# EasyEDA Pro project ProProject_si5351-clock_2024-06-27.epro

# Schematic Schematic1
Create Date: 2024-05-31; Page Name: P1; Project Name: si5351-clock; Schematic Name: Schematic1; Update Date: 2024-06-05; Company: EasyEDA.com; Drawn: EasyEDA; Page Size: A4; Part Number: JLCPCB-002; Reviewed: EasyEDA; Version: V0.1
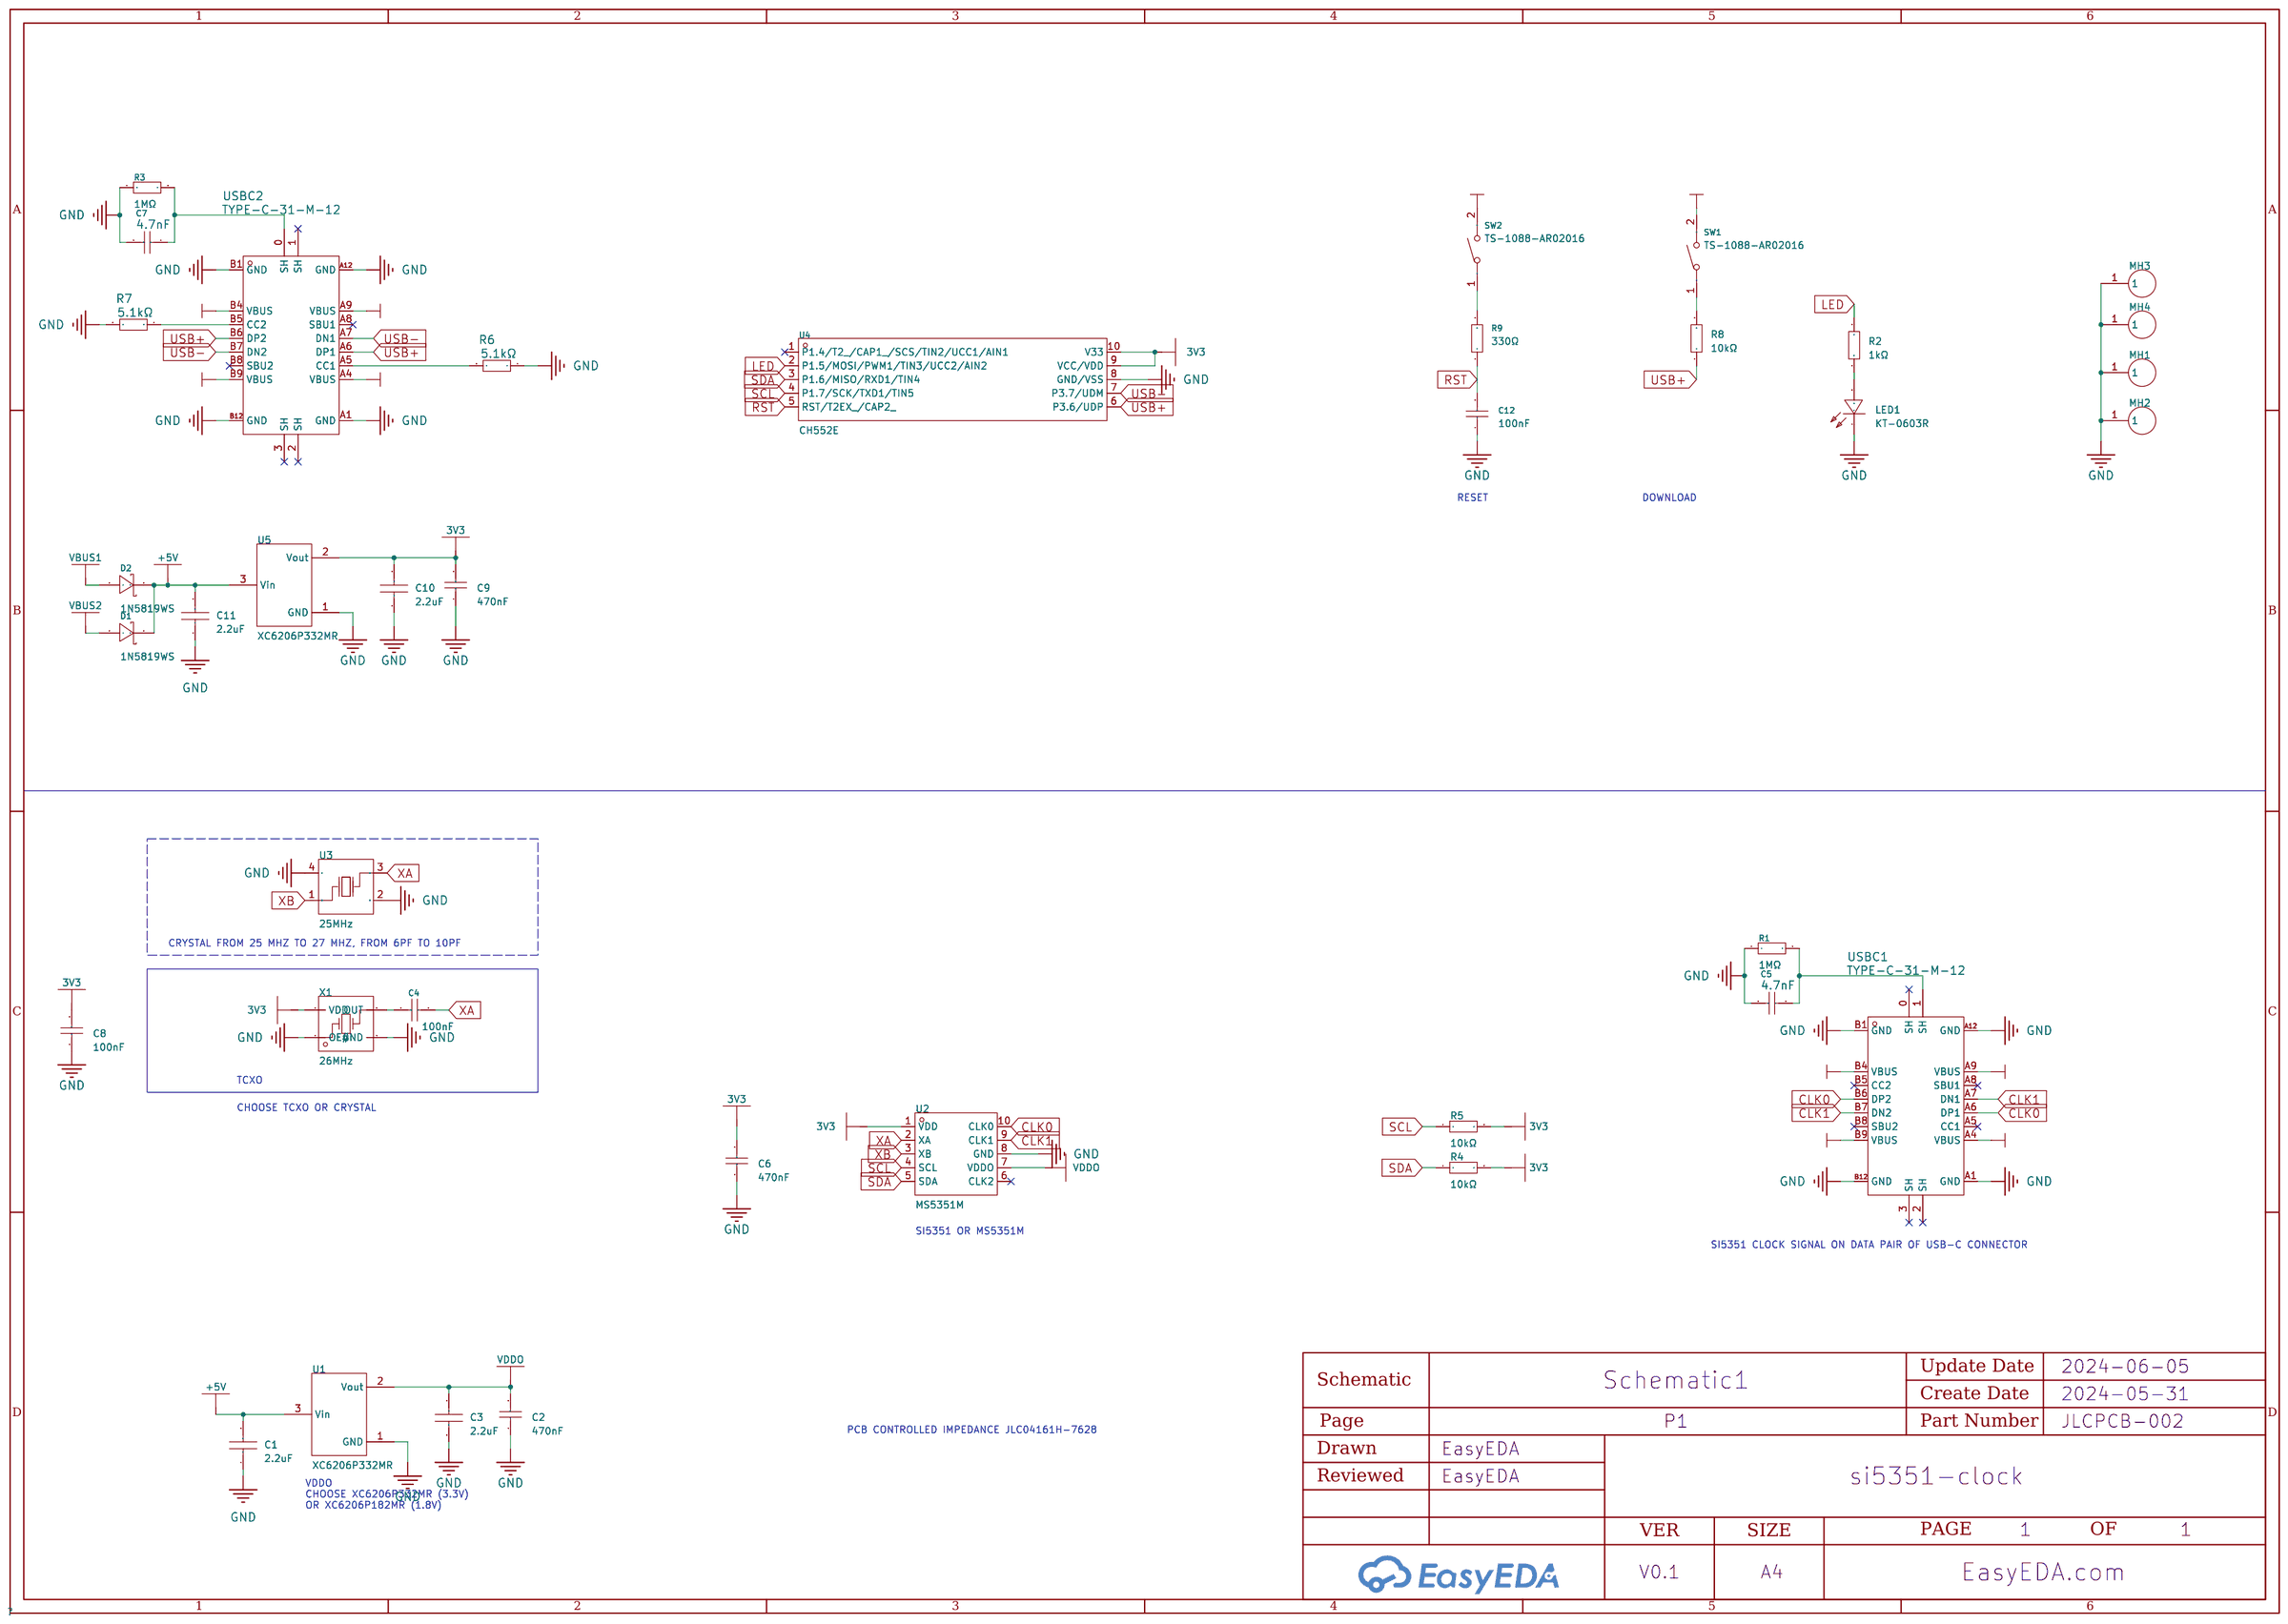
[diagram p0: schematic sheet]

## Parts
C1  2.2uF  [C0402]
C2  470nF  [C0402]
C3  2.2uF  [C0402]
C4  100nF  [C0402]
C5  4.7nF  [C0402]
C6  470nF  [C0402]
C7  4.7nF  [C0402]
C8  100nF  [C0402]
C9  470nF  [C0402]
C10  2.2uF  [C0402]
C11  2.2uF  [C0402]
C12  100nF  [C0402]
D1  1N5819WS  [SOD-323_L1.8-W1.3-LS2.5-RD]
D2  1N5819WS  [SOD-323_L1.8-W1.3-LS2.5-RD]
LED1  KT-0603R  [LED0603-RD]
MH1  -  [3.2mm MountingHole]  (no BOM)
MH2  -  [3.2mm MountingHole]  (no BOM)
MH3  -  [3.2mm MountingHole]  (no BOM)
MH4  -  [3.2mm MountingHole]  (no BOM)
R1  1MΩ  [R0402]
R2  1kΩ  [R0402]
R3  1MΩ  [R0402]
R4  10kΩ  [R0402]
R5  10kΩ  [R0402]
R6  5.1kΩ  [R0402]
R7  5.1kΩ  [R0402]
R8  10kΩ  [R0402]
R9  330Ω  [R0402]
SW1  TS-1088-AR02016  [SW-SMD_L3.9-W3.0-P4.45]
SW2  TS-1088-AR02016  [SW-SMD_L3.9-W3.0-P4.45]
U1  XC6206P332MR  [SOT-23-3_L2.9-W1.6-P1.90-LS2.8-BR]
U2  MS5351M  [MSOP-10_L3.0-W3.0-P0.50-LS5.0-BL]
U3  25MHz  [CRYSTAL-SMD_4P-L3.2-W2.5-BL-1]  (no BOM)
U4  CH552E  [MSOP-10_L3.0-W3.0-P0.50-LS5.0-BL]
U5  XC6206P332MR  [SOT-23-3_L2.9-W1.6-P1.90-LS2.8-BR]
USBC1  TYPE-C-31-M-12  [USB-C_SMD-TYPE-C-31-M-12]
USBC2  TYPE-C-31-M-12  [USB-C_SMD-TYPE-C-31-M-12]
X1  26MHz  [OSC-SMD_4P-L3.2-W2.5-BL_1XTV]

## Library data of the parts
C1 C3 C10 C11 = CL05A225MQ5NSNC: Capacitance: Tolerance:±20% Tolerance:±20% Voltage Rated: Temperature Coefficient:; LCSC Part Name: 2.2uF ±20% 6.3V; Supplier Part: C12530; Manufacturer: SAMSUNG(三星); Supplier Footprint: 0402; JLCPCB Part Class: Basic Part; Datasheet: https://atta.szlcsc.com/upload/public/pdf/source/20160218/1457707763339.pdf; Supplier: LCSC; Tolerance: ±20%
C2 C6 C9 = CL05A474KP5NNNC: Capacitance: Tolerance:±10% Tolerance:±10% Voltage Rated: Temperature Coefficient:; LCSC Part Name: 470nF ±10% 10V; Supplier Part: C47339; Manufacturer: SAMSUNG(三星); Supplier Footprint: 0402; JLCPCB Part Class: Extended Part; Datasheet: https://atta.szlcsc.com/upload/public/pdf/source/20160218/1457707763339.pdf; Supplier: LCSC; Tolerance: ±10%
C4 C8 C12 = CL05B104KO5NNNC: Capacitance:Tolerance:±10%Tolerance:±10%VoltageRated:TemperatureCoefficient:; LCSC Part Name: 100nF±10%16V; Supplier Part: C1525; Manufacturer: SAMSUNG(三星); Supplier Footprint: 0402; JLCPCB Part Class: BasicPart; Datasheet: https://atta.szlcsc.com/upload/public/pdf/source/20160103/1457707674891.pdf; Supplier: LCSC; Tolerance: ±10%
C5 C7 = 4.7nF: link: https://item.szlcsc.com/15869.html; 3DModel: C0402_L1.0-W0.5-H0.5; Supplier: LCSC; Manufacturer: FH(风华); Manufacturer Part: 0402B472K500NT; Supplier Part: C1538; JLCPCB Part Class: BasicPart
D1 D2 = 1N5819WS_C191023: Forward Voltage (Vf@If):600mV@1A Reverse Voltage (Vr):40V Average Rectified Current (Io):1A; LCSC Part Name: 电压:40V 电流:1A; Supplier Part: C191023; Manufacturer: Hottech(合科泰); Supplier Footprint: SOD-323; JLCPCB Part Class: Basic Part; Datasheet: https://atta.szlcsc.com/upload/public/pdf/source/20220428/3CB86FD8D28D653594B4E35F9D5AEFD9.pdf; Supplier: LCSC; Forward Voltage (Vf@If): 600mV@1A; Reverse Voltage (Vr): 40V; Average Rectified Current (Io): 1A
LED1 = KT-0603R: Emitted Color:Red Power Dissipation:- Forward Current:- Dominant Wavelength:- Dominant Wavelength:- Peak Wavelength:- Diode Configuration:- Lens Color:- Color Temperature:- Color Temperature:- Viewing Angle:- Mounting Sytle:- Operating Temperature:-40℃~+8; LCSC Part Name: 0603 红灯 高亮; Supplier Part: C2286; Manufacturer: KENTO; Supplier Footprint: 0603; JLCPCB Part Class: Basic Part; Datasheet: https://atta.szlcsc.com/upload/public/pdf/source/20160616/1466072038404.pdf; Supplier: LCSC; Emitted Color: Red; Operating Temperature: -40℃~+85℃
MH1-MH4 = 3.2mm Mounting Hole: M3
R1 R3 = 0402WGF1004TCE: Resistance:1000000Ω Tolerance:±1% Tolerance:±1% Power(Watts): Overload Voltage (Max): Temperature Coefficient:±100ppm/℃ Temperature Coefficient:±100ppm/℃ Type:Thick Film Resistors Operating Temperature Range:-55℃~+155℃ Operating Temperature Range:-55℃~+15; LCSC Part Name: 1MΩ ±1% 62.5mW 厚膜电阻; Supplier Part: C26083; Manufacturer: UNI-ROYAL(厚声); Supplier Footprint: 0402; JLCPCB Part Class: Basic Part; Datasheet: https://atta.szlcsc.com/upload/public/pdf/source/20200306/C422600_1E6D84923E4A46A82E41ADD87F860B5C.pdf; Supplier: LCSC; Tolerance: ±1%; Temperature Coefficient: ±100ppm/℃; Type: Thick Film Resistors; Operating Temperature Range: -55℃~+155℃
R2 = 0402WGF1001TCE: Type:ThickFilmResistorsResistance:Tolerance:±1%Tolerance:±1%Power(Watts):TemperatureCoefficient:±100ppm/℃TemperatureCoefficient:±100ppm/℃OverloadVoltage(Max):OperatingTemperatureRange:-55℃~+155℃OperatingTemperatureRange:-55℃~+155℃; LCSC Part Name: 1kΩ±1%62.5mW; Supplier Part: C11702; Manufacturer: UNI-ROYAL(厚声); Supplier Footprint: 0402; JLCPCB Part Class: BasicPart; Datasheet: https://atta.szlcsc.com/upload/public/pdf/source/20200306/C422600_1E6D84923E4A46A82E41ADD87F860B5C.pdf; Supplier: LCSC; Type: ThickFilmResistors; Tolerance: ±1%; Temperature Coefficient: ±100ppm/℃; Operating Temperature Range: -55℃~+155℃
R4 R5 R8 = 0402WGF1002TCE: Type:ThickFilmResistorsResistance:Tolerance:±1%Tolerance:±1%Power(Watts):TemperatureCoefficient:±100ppm/℃TemperatureCoefficient:±100ppm/℃OverloadVoltage(Max):OperatingTemperatureRange:-55℃~+155℃OperatingTemperatureRange:-55℃~+155℃; LCSC Part Name: 10kΩ±1%62.5mW; Supplier Part: C25744; Manufacturer: UNI-ROYAL(厚声); Supplier Footprint: 0402; JLCPCB Part Class: BasicPart; Datasheet: https://atta.szlcsc.com/upload/public/pdf/source/20200306/C422600_1E6D84923E4A46A82E41ADD87F860B5C.pdf; Supplier: LCSC; Type: ThickFilmResistors; Tolerance: ±1%; Temperature Coefficient: ±100ppm/℃; Operating Temperature Range: -55℃~+155℃
R6 R7 = 5.1kΩ: link: https://item.szlcsc.com/323315.html; 3DModel: R0402_L1.0-W0.5-H0.5; Supplier: LCSC; Manufacturer: UNI-ROYAL(厚声); Manufacturer Part: 0402WGF5101TCE; Supplier Part: C25905; Resistance: 5.1K; JLCPCB Part Class: BasicPart
R9 = 0402WGF3300TCE: Type:Thick Film Resistors Resistance: Tolerance:±1% Tolerance:±1% Power(Watts): Overload Voltage (Max): Temperature Coefficient:±100ppm/℃ Temperature Coefficient:±100ppm/℃ Operating Temperature Range:-55℃~+155℃ Operating Temperature Range:-55℃~+155℃; LCSC Part Name: 330Ω ±1% 62.5mW 厚膜电阻; Supplier Part: C25104; Manufacturer: UNI-ROYAL(厚声); Supplier Footprint: 0402; JLCPCB Part Class: Basic Part; Datasheet: https://atta.szlcsc.com/upload/public/pdf/source/20200306/C422600_1E6D84923E4A46A82E41ADD87F860B5C.pdf; Supplier: LCSC; Type: Thick Film Resistors; Tolerance: ±1%; Temperature Coefficient: ±100ppm/℃; Operating Temperature Range: -55℃~+155℃
SW1 SW2 = TS-1088-AR02016: Circuit:SPST Actuator Style:Round Button Operating Force:160gf Mounting Style:Brick nogging Switch Length:4mm Switch Width:3mm Switch Height:2mm Strike Gundam:不带 Contact Current:50mA Voltage Rating (DC):12V Insulation Resistance:100MΩ Actuator/Cap Color:B; LCSC Part Name: 4*3*2mm 立贴 轻触开关; Supplier Part: C720477; Manufacturer: XUNPU(讯普); Supplier Footprint: SMD; JLCPCB Part Class: Extended Part; Datasheet: https://atta.szlcsc.com/upload/public/pdf/source/20200810/C720475_60D09DD6C54279ADDB2DC25100F1CC11.pdf; Supplier: LCSC; Circuit: SPST; Actuator Style: Round Button; Operating Force: 160gf; Mounting Style: Brick nogging; Switch Length: 4mm; Switch Width: 3mm; Switch Height: 2mm; Strike Gundam: 不带; Contact Current: 50mA; Voltage Rating (DC): 12V; Insulation Resistance: 100MΩ; Actuator/Cap Color: Black; Pin Style: SMDSplicing; Mechanical Life: 10万次; Operating Temperature: -30℃~+80℃
U1 U5 = XC6206P332MR_C5446: OutputType:OutputPolarity:PositiveNumberofOutputs:1MaximumInputVoltage:6VOutputVoltage:3.3V~3.3VOutputVoltage:3.3V~3.3VDropoutVoltage:680mV@(100mA)OutputCurrent:200mAPowerSupplyRejectionRatio(PSRR):-; Supplier Part: C5446; Manufacturer: TOREX(特瑞仕); Supplier Footprint: SOT-23-3L; JLCPCB Part Class: BasicPart; Datasheet: https://atta.szlcsc.com/upload/public/pdf/source/20130801/1457706628791.pdf; Supplier: LCSC; Output Polarity: Positive; Number of Outputs: 1; Maximum Input Voltage: 6V; Output Voltage: 3.3V~3.3V; Dropout Voltage: 680mV@(100mA); Output Current: 200mA
U2 = MS5351M: Interface:I2C Output Frequency (Max):200MHz Supply Voltage:2.25V~3.6V Supply Voltage:2.25V~3.6V Number of Outputs:3 Output Low Voltage:600mV Output Low Voltage:600mV Output High Voltage:2.7V Output High Voltage:2.7V Operating Temperatue:-55℃~+150℃ Operati; Supplier Part: C1509083; Manufacturer: 杭州瑞盟; Supplier Footprint: MSOP-10; JLCPCB Part Class: Extended Part; Datasheet: https://atta.szlcsc.com/upload/public/pdf/source/20201224/C1509083_CDA7065E1A3FD8463EE02C96BD32A982.pdf; Supplier: LCSC; Interface: I2C; Output Frequency (Max): 200MHz; Supply Voltage: 2.25V~3.6V; Number of Outputs: 3; Output Low Voltage: 600mV; Output High Voltage: 2.7V; Operating Temperatue: -55℃~+150℃
U3 = 3225-25-10-10-10/A: Frequency:25MHz Normal temperature Frequency Tolerance:±10ppm Normal temperature Frequency Tolerance:±10ppm External load capacitor: Operating Temperature: Operating Temperature:; LCSC Part Name: 25MHz ±10ppm 10pF; Supplier Part: C2981674; Manufacturer: LIMING(利明); Supplier Footprint: SMD3225-4P; JLCPCB Part Class: Extended Part; Datasheet: https://atta.szlcsc.com/upload/public/pdf/source/20220322/AC676597CC3A40062114C19917D1493D.pdf; Supplier: LCSC; Normal temperature Frequency Tolerance: ±10ppm
U4 = CH552E: CPU Core:51Series Program Storage Size:16KB RAM Size:1.25KB GPIO Ports Number:- Operating Voltage Range:3.3V~5V Operating Voltage Range:3.3V~5V CPU Maximum Speed:24MHz Program Memory Type:FLASH Operating Temperature Range:-40℃~+85℃ Operating Temperature R; Supplier Part: C967938; Manufacturer: WCH(南京沁恒); Supplier Footprint: MSOP-10; JLCPCB Part Class: Extended Part; Datasheet: https://atta.szlcsc.com/upload/public/pdf/source/20210113/C967938_1C35FF7046C581C5764B019C00B201EC.pdf; Supplier: LCSC; CPU Core: 51Series; Program Storage Size: 16KB; RAM Size: 1.25KB; Operating Voltage Range: 3.3V~5V; CPU Maximum Speed: 24MHz; Program Memory Type: FLASH; Operating Temperature Range: -40℃~+85℃; ADC (Bit): 8bit; PWM (Bit): 8bit; 16Bit Timer: 3; UART/USART: 2; SPI: 1; Universal Serial Bus: 有; Peripheral/Function: DMA；WDT；CCP捕获/比较；Touch button; Watchdog: 有; CCP Capture/Compare: 有; Direct Memory Access: 有; Internal Oscillator: 有
USBC1 USBC2 = TYPE-C-31-M-12: link: https://so.szlcsc.com/global.html?c=&amp;k=C165948; Supplier: LCSC; Supplier Part: C165948; Manufacturer: 韩国韩荣; JLCPCB Part Class: ExtendedPart
X1 = 1XTW26000MAA: Frequency: Frequency Stability(Full temperature range):±0.5ppm Frequency Stability(Full temperature range):±0.5ppm Supply Voltage:1.7V~3.6V Supply Voltage:1.7V~3.6V Supply Current (Max):- Operating Temperature: Operating Temperature:; LCSC Part Name: 26MHz ±0.5ppm 1.7V~3.6V; Supplier Part: C213404; Manufacturer: KDS(大真空); Supplier Footprint: SMD3225-4P; JLCPCB Part Class: Extended Part; Datasheet: https://atta.szlcsc.com/upload/public/pdf/source/20220526/5E8AD46F484F5D63EE5B4F866693FFBE.pdf; Supplier: LCSC; Frequency Stability(Full temperature range): ±0.5ppm; Supply Voltage: 1.7V~3.6V

## Nets
3V3: C6.2 C8.2 C9.2 C10.2 R4.2 R5.2 SW1.2 SW2.2 U2.1(VDD) U4.9(VCC/VDD) U4.10(V33) U5.2(Vout) X1.4(VDD)
+5V: C1.2 C11.2 D1.1(K) D2.1(K) U1.3(Vin) U5.3(Vin)
GND: C1.1 C2.1 C3.1 C5.1 C6.1 C7.1 C8.1 C9.1 C10.1 C11.1 C12.1 LED1.1(K) MH1.1 MH2.1 MH3.1 MH4.1 R1.1 R3.1 R6.1 R7.2 U1.1(GND) U2.8(GND) U3.2(GND) U3.4(GND) U4.8(GND/VSS) U5.1(GND) USBC1.A1(GND) USBC1.A12(GND) USBC1.B1(GND) USBC1.B12(GND) USBC2.A1(GND) USBC2.A12(GND) USBC2.B1(GND) USBC2.B12(GND) X1.1(OE#) X1.2(GND)
VBUS1: D2.2(A) USBC2.A4(VBUS) USBC2.A9(VBUS) USBC2.B4(VBUS) USBC2.B9(VBUS)
VBUS2: D1.2(A) USBC1.A4(VBUS) USBC1.A9(VBUS) USBC1.B4(VBUS) USBC1.B9(VBUS)
VDDO: C2.2 C3.2 U1.2(Vout) U2.7(VDDO)
CLK0: U2.10(CLK0) USBC1.A6(DP1) USBC1.B6(DP2)
CLK1: U2.9(CLK1) USBC1.A7(DN1) USBC1.B7(DN2)
LED: R2.2 U4.2(P1.5/MOSI/PWM1/TIN3/UCC2/AIN2)
RST: C12.2 R9.1 U4.5(RST/T2EX_/CAP2_)
SCL: R5.1 U2.4(SCL) U4.4(P1.7/SCK/TXD1/TIN5)
SDA: R4.1 U2.5(SDA) U4.3(P1.6/MISO/RXD1/TIN4)
USB+: R8.1 U4.6(P3.6/UDP) USBC2.A6(DP1) USBC2.B6(DP2)
USB-: U4.7(P3.7/UDM) USBC2.A7(DN1) USBC2.B7(DN2)
XA: C4.2 U2.2(XA) U3.3(OSC2)
XB: U2.3(XB) U3.1(OSC1)
$1N4118: R8.2 SW1.1
$1N7734: R7.1 USBC2.B5(CC2)
$1N7735: R6.2 USBC2.A5(CC1)
$1N9628: C5.2 R1.2 USBC1.1(SH)
$1N15892: LED1.2(A) R2.1
$1N26853: C4.1 X1.3(OUT)
$1N62932: C7.2 R3.2 USBC2.0(SH)
$1N71108: R9.2 SW2.1

Not connected (* = marked no-connect by the designer): U2 6(CLK2)*; U4 1(P1.4/T2_/CAP1_/SCS/TIN2/UCC1/AIN1)*; USBC1 0(SH)* 2(SH)* 3(SH)* A5(CC1)* A8(SBU1)* B5(CC2)* B8(SBU2)*; USBC2 1(SH)* 2(SH)* 3(SH)* A8(SBU1)* B8(SBU2)*

## Notes on the sheet
- RESET
- DOWNLOAD
- CRYSTAL FROM 25 MHZ TO 27 MHZ, FROM 6PF TO 10PF
- TCXO
- CHOOSE TCXO OR CRYSTAL
- SI5351 OR MS5351M
- SI5351 CLOCK SIGNAL ON DATA PAIR OF USB-C CONNECTOR
- PCB CONTROLLED IMPEDANCE JLC04161H-7628
- VDDO
  CHOOSE XC6206P332MR (3.3V)
  OR XC6206P182MR (1.8V)

# Board PCB1
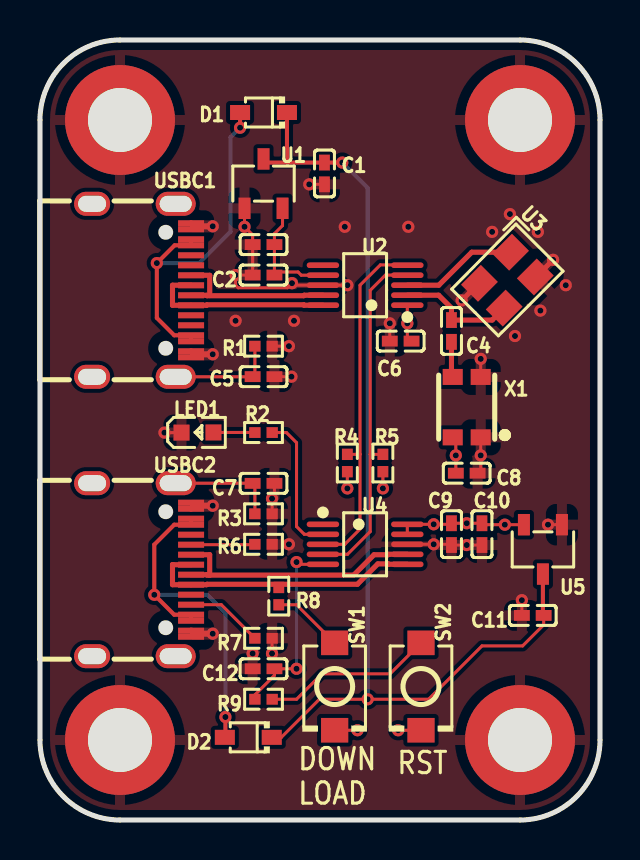
[diagram p1: board, top side]
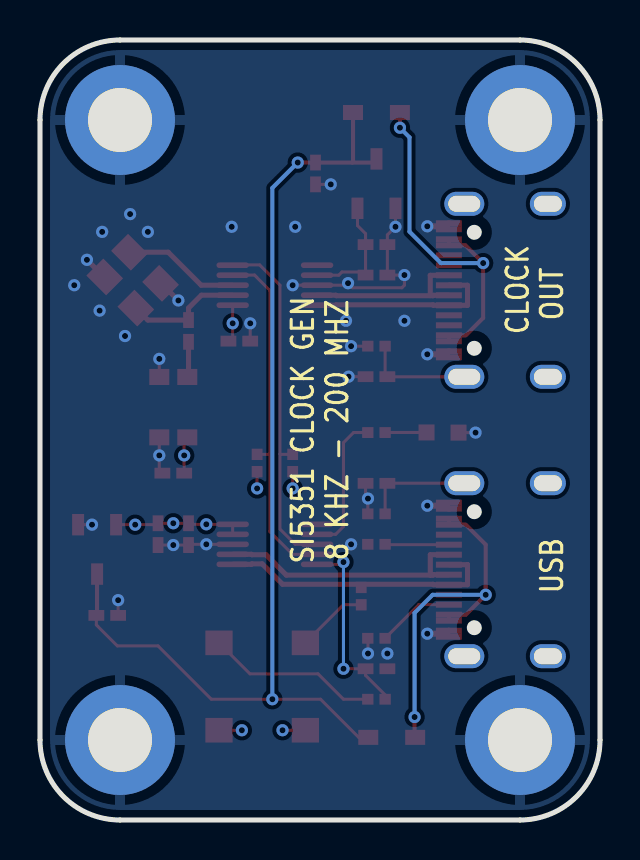
[diagram p2: board, bottom side, seen from below]

Outline 28 x 39 mm; copper layers: Top Layer, Inner1, Inner2, Bottom Layer. Coordinates in mm from the lower left corner of the outline.
Outline path: 0,35 0,4 arc(1.17,1.17) 4,0 24,0 arc(26.83,1.17) 28,4 28,35 arc(26.83,37.83) 24,39 4,39 arc(1.17,37.83) 0,35
Stack: Top Layer 0.035mm 外层铜厚1oz / Dielectric1 0.2104mm 7628 RC49% 8.6mil / Inner1 0.0152mm 内层铜厚 / Dielectric2 1.065mm 1.1mm H/HOZ 含铜 / Inner2 0.0152mm 内层铜厚 / Dielectric3 0.2104mm 7628 RC49% 8.6mil / Bottom Layer 0.035mm 外层铜厚1oz

## Design rules (mm)
net USB+: DP1
net USB-: DP1
net CLK1: DP2
net CLK0: DP2
template: Custom Config
spacing copperThickness1oz (default): track to track 0.102, other pairs 0.152 to 0.3
spacing copperThickness2oz: track to track 0.203, other pairs 0.152 to 0.3
track width copperThickness1oz (default): min 0.127, default 0.254, max 2.54
track width copperThickness2oz: min 0.203, default 0.254, max 2.54
differential pair differentialPair (default): width min 0.127, default 0.254, max 2.54; gap min 0.152, default 0.203
via viaSize (default): diameter min 0.5, default 0.61, max 10; hole min 0.3, default 0.305, max 6.299

## Placement (name value [footprint] x y rotation side)
C1  2.2uF  [C0402]  14.22 32.33 90 top
C2  470nF  [C0402]  11.18 27.25 0 top
C3  2.2uF  [C0402]  11.18 28.77 0 top
C4  100nF  [C0402]  20.57 24.45 90 top
C5  4.7nF  [C0402]  11.18 22.17 180 top
C6  470nF  [C0402]  18.03 23.94 0 top
C7  4.7nF  [C0402]  11.18 16.83 180 top
C8  100nF  [C0402]  21.34 17.34 180 top
C9  470nF  [C0402]  20.57 14.29 90 top
C10  2.2uF  [C0402]  22.1 14.29 90 top
C11  2.2uF  [C0402]  24.64 10.23 0 top
C12  100nF  [C0402]  11.18 7.56 0 top
D1  1N5819WS  [SOD-323_L1.8-W1.3-LS2.5-RD]  11.18 35.38 180 top
D2  1N5819WS  [SOD-323_L1.8-W1.3-LS2.5-RD]  10.41 4.13 180 top
LED1  KT-0603R  [LED0603-RD]  7.87 19.37 0 top
MH1  -  [3.2mm MountingHole]  4 35 0 top
MH2  -  [3.2mm MountingHole]  24 35 0 top
MH3  -  [3.2mm MountingHole]  4 4 0 top
MH4  -  [3.2mm MountingHole]  24 4 0 top
R1  1MΩ  [R0402]  11.18 23.69 180 top
R2  1kΩ  [R0402]  11.18 19.37 0 top
R3  1MΩ  [R0402]  11.18 15.31 180 top
R4  10kΩ  [R0402]  15.37 17.85 270 top
R5  10kΩ  [R0402]  17.15 17.85 270 top
R6  5.1kΩ  [R0402]  11.18 13.78 180 top
R7  5.1kΩ  [R0402]  11.18 9.09 0 top
R8  10kΩ  [R0402]  11.94 11.19 270 top
R9  330Ω  [R0402]  11.18 6.04 0 top
SW1  TS-1088-AR02016  [SW-SMD_L3.9-W3.0-P4.45]  14.73 6.67 270 top
SW2  TS-1088-AR02016  [SW-SMD_L3.9-W3.0-P4.45]  19.05 6.67 270 top
U1  XC6206P332MR  [SOT-23-3_L2.9-W1.6-P1.90-LS2.8-BR]  11.18 31.82 270 top
U2  MS5351M  [MSOP-10_L3.0-W3.0-P0.50-LS5.0-BL]  16.26 26.74 90 top
U3  25MHz  [CRYSTAL-SMD_4P-L3.2-W2.5-BL-1]  23.37 26.99 225 top
U4  CH552E  [MSOP-10_L3.0-W3.0-P0.50-LS5.0-BL]  16.26 13.78 270 top
U5  XC6206P332MR  [SOT-23-3_L2.9-W1.6-P1.90-LS2.8-BR]  25.15 13.53 90 top
USBC1  TYPE-C-31-M-12  [USB-C_SMD-TYPE-C-31-M-12]  5.08 26.48 270 top
USBC2  TYPE-C-31-M-12  [USB-C_SMD-TYPE-C-31-M-12]  5.08 12.52 270 top
X1  26MHz  [OSC-SMD_4P-L3.2-W2.5-BL_1XTV]  21.34 20.64 90 top

## Footprints (pads in the part's own frame, mm; a bottom-side part is the same pattern mirrored in y, then rotated)
3.2mm MountingHole
  round 5.5 hole 3.2: 1(0,0)
C0402
  rect 0.79x0.54 smd: 1(-0.545,0) 2(0.545,0)
CRYSTAL-SMD_4P-L3.2-W2.5-BL-1
  rect 1.4x1.2 smd: 1(-1.1,-0.875) 2(1.1,-0.875) 3(1.1,0.875) 4(-1.1,0.875)
LED0603-RD
  rect 0.8x0.8 smd: 1(-0.799,-0.004) 2(0.799,0.004)
MSOP-10_L3.0-W3.0-P0.50-LS5.0-BL
  oval 0.28x1.62 smd: 1(-1,-2.11) 2(-0.5,-2.11) 3(0,-2.11) 4(0.5,-2.11) 5(1,-2.11) 6(1,2.11) 7(0.5,2.11) 8(0,2.11) 9(-0.5,2.11) 10(-1,2.11)
OSC-SMD_4P-L3.2-W2.5-BL_1XTV
  rect 0.8x1 smd: 1(-1.51,-0.7) 2(1.51,-0.7) 3(1.51,0.7) 4(-1.51,0.7)
R0402
  rect 0.566x0.54 smd: 1(-0.433,0) 2(0.433,0)
SOD-323_L1.8-W1.3-LS2.5-RD
  rect 1x0.75 smd: 1(-1.173,0) 2(1.173,0)
SOT-23-3_L2.9-W1.6-P1.90-LS2.8-BR
  rect 1.07x0.6 smd: 1(1.235,-0.95) 2(1.235,0.95) 3(-1.235,0)
SW-SMD_L3.9-W3.0-P4.45
  rect 1.23x1.36 smd: 1(-2.185,0) 2(2.185,0)
USB-C_SMD-TYPE-C-31-M-12
  oval 1.2x2 hole 0.8x1.6: 0(-4.325,1.706) 1(4.325,1.706)
  oval 1.2x1.8 hole 0.8x1.4: 2(4.325,-2.474) 3(-4.325,-2.474)
  rect 0.3x1.3 smd: A1(-3.35,2.474) A4(-2.55,2.474) A5(-1.25,2.474) A6(-0.25,2.474) A7(0.25,2.474) A8(1.25,2.474) A9(2.55,2.474) A12(3.35,2.474) B1(3.05,2.474) B4(2.25,2.474) B5(1.75,2.474) B6(0.75,2.474) B7(-0.75,2.474) B8(-1.75,2.474) B9(-2.25,2.474) B12(-3.05,2.474)

## Nets
As in the schematic.

Pads without a net: U2 6; U4 1; USBC1 0 2 3 A5 A8 B5 B8; USBC2 1 2 3 A8 B8

## Via types
v1: diameter 0.61, hole 0.305, Top Layer to Bottom Layer, 52 vias

## Routing (per net, layer and track width the routed paths; a pad name or vN(x,y) marks a point on that pad's centre or on a via; arc(x,y) is an arc through that point)
3V3: length 14.1
  Top Layer w0.152: U5.2 v1(23.24,14.77) 22.17,14.77 C10.2 v1(21.34,14.84) C9.2 20.52,14.78 U4.10 U4.9 ; U2.1 18.37,24.16 18.58,23.94 ; SW1.2 v1(15.88,4.49) ; v1(15.37,16.58) R4.2 ; v1(17.15,16.58) R5.2 ; v1(17.91,4.49) SW2.2 ; X1.4 20.79,18.98 C8.2
  vias: v1(18.37,24.83) v1(19.69,14.78) v1(20.79,18.23)
+5V: length 52.4
  Top Layer w0.152: D2.1 12.06,4.13 13.97,6.04 v1(16.38,6.04) 19.43,6.04 22.1,8.7 24.13,8.7 25.18,9.76 C11.2
  Top Layer w0.203: U5.3 25.15,10.27 C11.2 ; D1.1 12.35,32.91 12.38,32.87 ; v1(15.11,32.87) C1.2 12.38,32.87 ; 12.38,32.87 11.36,32.87 U1.3
  Bottom Layer w0.203: v1(15.11,32.87) 16.38,31.6 v1(16.38,6.04)
GND: length 32.3
  Top Layer w0.152: C7.1 11.72,16.19 v1(11.6,16.07) 11.61,16.06 R3.1 ; C10.1 v1(21.34,13.75) C9.1 20.54,13.78 U4.8 ; R1.1 v1(12.45,23.69) ; X1.2 v1(22.04,23.06) ; U1.1 v1(10.23,29.66) 10.63,29.25 C3.1 C2.1 v1(9.78,27.25) 9.78,26.74 9.91,26.61 12.37,26.61 v1(12.6,26.84) 12.7,26.74 U2.8 v1(15.37,26.74) ; v1(25.4,14.77) U5.1 ; C5.1 v1(12.57,22.17) ; C6.1 v1(17.49,24.83) ; v1(11.6,8.32) 11.6,9.08 R7.2 ; v1(13.46,31.78) C1.1 ; 24.09,10.23 v1(24.09,10.99) ; v1(6.22,19.37) LED1.1 ; 21.97,19.07 X1.1 v1(22.04,18.23) 22.04,17.5 C8.1
  Top Layer w0.254: v1(25.65,28.01) 24.8,27.15 U3.4 ; U3.2 21.94,26.83 v1(21.08,25.98)
  Top Layer w0.305: v1(8.64,15.72) 7.7,15.72 USBC2.B12 ; USBC2.B1 7.7,9.31 v1(8.64,9.31) ; USBC1.A1 7.7,29.69 v1(8.64,29.69) ; USBC1.B1 7.7,23.28 v1(8.64,23.28)
  vias: v1(9.78,24.96) v1(10.63,8.32) v1(12.45,13.78) v1(12.7,24.96) v1(15.24,29.66) v1(18.41,29.66) v1(19.69,13.78) v1(22.61,29.41) v1(23.5,30.3) v1(23.75,24.2) v1(24.89,29.41) v1(25.02,25.47) v1(26.29,26.74)
VBUS1: length 17.8
  Top Layer w0.203: USBC2.A4 USBC2.B9 6.71,14.77 5.72,13.77 v1(5.72,11.26) 6.71,10.27 USBC2.B4 USBC2.A9 ; D2.2 9.27,4.16 v1(9.27,5.15)
  Bottom Layer w0.203: v1(5.72,11.26) 8.37,11.26 9.27,10.36 v1(9.27,5.15)
VBUS2: length 18
  Top Layer w0.203: D1.2 v1(10,34.61) ; USBC1.A9 USBC1.B4 6.71,24.23 5.84,25.1 v1(5.84,27.85) 6.73,28.73 USBC1.B9 USBC1.A4
  Bottom Layer w0.203: v1(5.84,27.85) 7.96,27.85 9.53,29.42 9.53,34.13 v1(10,34.61)
VDDO: length 6.1
  Top Layer w0.152: U2.7 13.06,27.24 12.9,27.4 11.87,27.4 C2.2 C3.2 11.72,29.32 12.13,29.72 U1.2
CLK0: length 9.5
  Top Layer w0.254: 8.35,25.76 13.19,25.76 13.21,25.74 U2.10 ; 8.35,25.76 8.33,25.73 USBC1.B6 6.62,25.73 6.62,26.74 7.55,26.74 USBC1.A6
CLK1: length 8.6
  Top Layer w0.254: 13.19,26.22 13.21,26.24 U2.9 ; 13.19,26.21 8.35,26.21 8.33,26.23 USBC1.A7 ; 8.49,26.22 8.49,27.23 USBC1.B7
LED: length 7.1
  Top Layer w0.152: U4.2 13.22,14.28 12.83,14.67 12.83,18.86 12.32,19.37 R2.2
RST: length 9.7
  Top Layer w0.152: R9.1 10.74,6.25 11.72,7.23 C12.2 v1(12.83,7.56) ; v1(12.83,12.9) 12.94,12.78 U4.5
  Bottom Layer w0.152: v1(12.83,7.56) v1(12.83,12.9)
SCL: length 17.7
  Top Layer w0.152: U2.4 18.36,27.25 17.27,27.25 16.51,26.48 16.51,18.29 ; U4.4 15.38,13.28 16.51,14.42 16.51,18.29 ; 16.51,18.29 16.52,18.28 17.15,18.28
SDA: length 17.8
  Top Layer w0.152: 15.37,18.28 16,18.28 16,18.29 ; 16,18.29 16,26.74 17.02,27.75 18.35,27.75 U2.5 ; 16,18.29 16,14.55 15.24,13.78 U4.3
USB+: length 14.1
  Top Layer w0.254: U4.6 17.43,12.78 17.41,12.81 16.89,12.81 15.87,11.79 8.35,11.79 8.33,11.77 USBC2.B6 6.62,11.77 6.62,12.77 6.63,12.77 USBC2.A6
USB-: length 13.2
  Top Layer w0.254: USBC2.A7 8.33,12.27 8.35,12.24 8.48,12.24 ; 8.48,12.24 8.48,13.27 USBC2.B7 ; 8.48,12.24 15.68,12.24 16.7,13.26 17.41,13.26 17.43,13.28 U4.7
XA: length 6
  Top Layer w0.254: U3.3 22.61,25 C4.2 20.57,25.6 19.93,26.24 U2.2
XB: length 5.8
  Top Layer w0.254: U2.3 19.94,26.74 21.59,28.39 U3.1
$1N4118: length 3.6
  Top Layer w0.152: SW1.1 12.83,10.76 R8.2
$1N7734: length 3.9
  Top Layer w0.152: R7.1 9.06,10.77 USBC2.B5
$1N7735: length 3.2
  Top Layer w0.152: R6.2 10.72,13.77 USBC2.A5
$1N9628: length 5.4
  Top Layer w0.152: R1.2 10.74,22.28 C5.2 10.62,22.16 USBC1.1
$1N15892: length 2.1
  Top Layer w0.152: LED1.2 10.74,19.38 R2.1
$1N26853: length 1.8
  Top Layer w0.254: C4.1 20.57,22.22 X1.3
$1N62932: length 5.4
  Top Layer w0.152: R3.2 10.74,16.72 C7.2 10.62,16.84 USBC2.0
$1N71108: length 8.6
  Top Layer w0.152: SW2.1 17.5,7.31 14.1,7.31 12.83,6.04 R9.2

## Copper pours and planes (outline as drawn; the poured copper is in the pictures)
3V3 on Inner2: -2.41,41.6 30.48,41.6 30.48,-1.58 -2.41,-1.58
GND on Top Layer: -3.68,42.87 31.5,42.87 31.5,-2.73 -3.68,-2.73
GND on Bottom Layer: -4.83,44.14 32.51,44.14 32.51,-3.74 -4.83,-3.74
GND on Inner1: -1.14,40.07 29.34,40.07 29.34,-0.31 -1.14,-0.31

## Text on the board
Bottom Silkscreen Layer: CLOCK / OUT | USB | SI5351 CLOCK GEN / 8 KHZ - 200 MHZ
Top Silkscreen Layer: DOWN / LOAD | RST
